# Altium schematic sheet ESP32.SchDoc
size A4
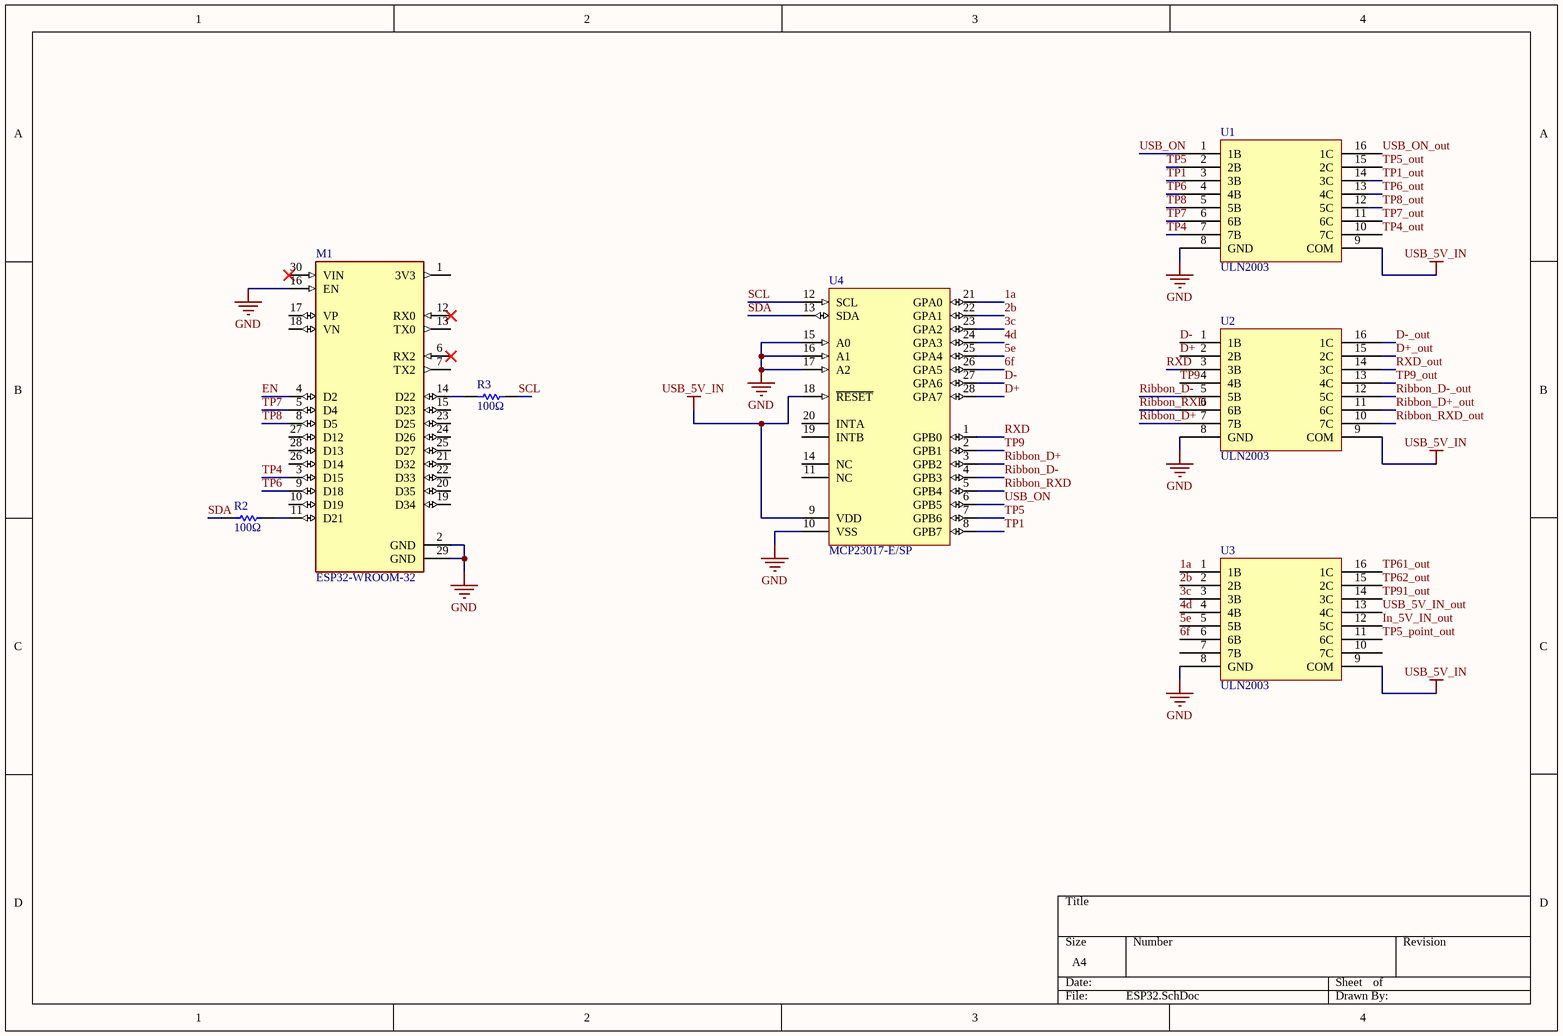
[diagram p0: ESP32.SchDoc]

## Parts
M1  ESP32-WROOM-32  [ESP32-DEVKIT-V1]
R2  100Ω  [RESC2013X60X40ML20T25]
R3  100Ω  [RESC2013X60X40ML20T25]
U1  ULN2003  [SOP127P600X175-16N]
U2  ULN2003  [SOP127P600X175-16N]
U3  ULN2003  [SOP127P600X175-16N]
U4  MCP23017-E/SP  [SPDIP300-SP28]

## Nets
GND: M1.2(GND) M1.16(EN) M1.29(GND) U1.8(GND) U2.8(GND) U3.8(GND) U4.10(VSS) U4.15(A0) U4.16(A1) U4.17(A2)
USB_5V_IN: U1.9(COM) U2.9(COM) U3.9(COM) U4.9(VDD) U4.18(~{RESET})
1a: U3.1(1B) U4.21(GPA0)
2b: U3.2(2B) U4.22(GPA1)
3c: U3.3(3B) U4.23(GPA2)
4d: U3.4(4B) U4.24(GPA3)
5e: U3.5(5B) U4.25(GPA4)
6f: U3.6(6B) U4.26(GPA5)
D+: U2.2(2B) U4.28(GPA7)
D+_out: U2.15(2C)
D-: U2.1(1B) U4.27(GPA6)
D-_out: U2.16(1C)
EN: M1.4(D2)
In_5V_IN_out: U3.12(5C)
Ribbon_D+: U2.7(7B) U4.3(GPB2)
Ribbon_D+_out: U2.11(6C)
Ribbon_D-: U2.5(5B) U4.4(GPB3)
Ribbon_D-_out: U2.12(5C)
Ribbon_RXD: U2.6(6B) U4.5(GPB4)
Ribbon_RXD_out: U2.10(7C)
RXD: U2.3(3B) U4.1(GPB0)
RXD_out: U2.14(3C)
SCL: R3.2 U4.12(SCL)
SDA: R2.1 U4.13(SDA)
TP1: U1.3(3B) U4.8(GPB7)
TP1_out: U1.14(3C)
TP4: M1.3(D15) U1.7(7B)
TP4_out: U1.10(7C)
TP5: U1.2(2B) U4.7(GPB6)
TP5_out: U1.15(2C)
TP5_point_out: U3.11(6C)
TP6: M1.9(D18) U1.4(4B)
TP6_out: U1.13(4C)
TP7: M1.5(D4) U1.6(6B)
TP7_out: U1.11(6C)
TP8: M1.8(D5) U1.5(5B)
TP8_out: U1.12(5C)
TP9: U2.4(4B) U4.2(GPB1)
TP9_out: U2.13(4C)
TP61_out: U3.16(1C)
TP62_out: U3.15(2C)
TP91_out: U3.14(3C)
USB_5V_IN_out: U3.13(4C)
USB_ON: U1.1(1B) U4.6(GPB5)
USB_ON_out: U1.16(1C)
NetM1_11: M1.11(D21) R2.2
NetM1_14: M1.14(D22) R3.1

Not connected (* = marked no-connect by the designer): M1 1(3V3) 6(RX2)* 7(TX2) 10(D19) 12(RX0)* 13(TX0) 15(D23) 17(VP) 18(VN) 19(D34) 20(D35) 21(D32) 22(D33) 23(D25) 24(D26) 25(D27) 26(D14) 27(D12) 28(D13) 30(VIN)*; U3 7(7B) 10(7C); U4 11(NC) 14(NC) 19(INTB) 20(INTA)

## Library data of the parts
M1 = ESP32-DEVKIT-V1: Dual core, Wi-Fi: 2.4 GHz up to 150 Mbits/s,BLE (Bluetooth Low Energy) and legacy Bluetooth, 32 bits, Up to 240 MHz
R2 R3 = CMP-2001-00580-1: Res Thin Film 0805 100 Ohm 0.1% 1/8W ±25ppm/°C Molded SMD SMD Punched Carrier T/R; Manufacturer: Panasonic; Mfr. Part #: ERA6AEB101V
U1 = Component_1: SOP-16 Darlington Transistor Arrays ROHS; Manufacturer: Changjiang Electronics Tech; Mfr. Part #: ULN2003; Datasheet: https://datasheet.lcsc.com/lcsc/2108201930_Changjiang-Electronics-Tech--CJ-ULN2003_C2829422.pdf; Package: SOP-16; Unit Price: $ 0.2329
U2 U3 = Component_1: Manufacturer: Changjiang Electronics Tech; Mfr. Part #: ULN2003; Datasheet: https://datasheet.lcsc.com/lcsc/2108201930_Changjiang-Electronics-Tech--CJ-ULN2003_C2829422.pdf; Package: SOP-16; Unit Price: $ 0.2329
U4 = CMP-0186-00081-2: 16-Bit I/O Expander with Serial Interface, 28-Pin SPDIP, Extended Temperature; Manufacturer: Microchip Tech; RevisionNote: URLs added.; ComponentLink3Description: Package Specification; PackageVersion: revBB, Aug-2009; ComponentLink1Description: Manufacturer URL; DatasheetVersion: revB, Feb-2007; PackageDescription: 28-Lead Skinny Plastic Dual In-Line (SP) - 300 mil Body [SPDIP]; ComponentLink1URL: http://www.microchip.com/; PackageReference: SPDIP300-SP28; ComponentLink3URL: http://www.microchip.com/stellent/groups/techpub_sg/documents/packagingspec/en012702.pdf; ComponentLink2Description: Datasheet; ComponentLink2URL: http://ww1.microchip.com/downloads/en/DeviceDoc/21952b.pdf; Mfr. Part #: MCP23017-E/SP